# Altium schematic sheet power.SchDoc: Arduino_Power
size A4; DocumentNumber: 1; SheetNumber: 1; SheetTotal: 3
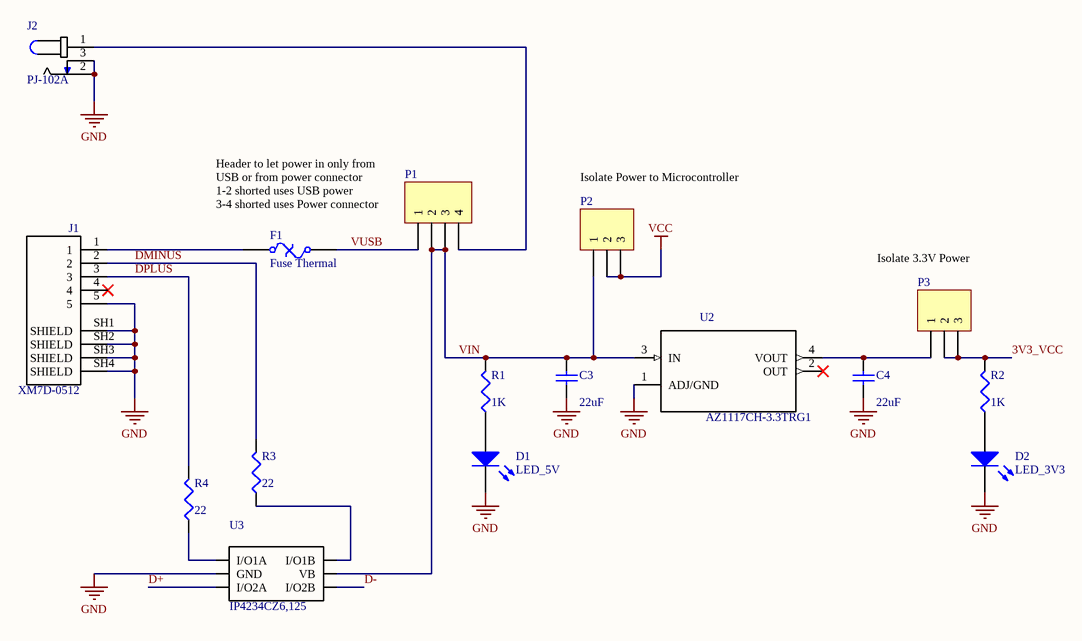
[diagram p0: power.SchDoc]

## Parts
C3  value 22uF  [C1206]  (hidden comment: Cap Semi)
C4  value 22uF  [C1206]  (hidden comment: Cap Semi)
D1  LED_5V  [3.2X1.6X1.1]
D2  LED_3V3  [3.2X1.6X1.1]
F1  Fuse Thermal  [1812]
J1  XM7D-0512  [*OMRON_XM7D-0512_XM7D-0512(Primary)]
J2  PJ-102A  [*CUI_PJ-102A]
P1  Header 4  [HDR1X4]  (value not drawn)
P2  ON   OFF  [HDR1X3]  (value not drawn)
P3  3.3 NC  [HDR1X3]  (value not drawn)
R1  value 1K  [C1206]  (hidden comment: Res3)
R2  value 1K  [C1206]  (hidden comment: Res3)
R3  value 22  [C1206]  (hidden comment: Res3)
R4  value 22  [C1206]  (hidden comment: Res3)
U2  AZ1117CH-3.3TRG1  [*SOT230P696X180-4N]
U3  IP4234CZ6,125  [*SOT-457]

## Nets
GND: C3.1 C4.1 D1.2(K) D2.2(K) J1.5 J1.SH1(SHIELD) J1.SH2(SHIELD) J1.SH3(SHIELD) J1.SH4(SHIELD) J2.2 J2.3 U2.1(ADJ/GND) U3.2(GND)
VCC: P2.2 P2.3
3V3_VCC: P3.2 P3.3 R2.2
D+: U3.3(I/O2A)
D-: U3.4(I/O2B)
DMINUS: J1.2 R3.2
DPLUS: J1.3 R4.2
VIN: C3.2 P1.2 P1.3 P2.1 R1.2 U2.3(IN) U3.5(VB)
VUSB: F1.2 P1.1
NetC4_2: C4.2 P3.1 U2.4(VOUT)
NetD1_1: D1.1(A) R1.1
NetD2_1: D2.1(A) R2.1
NetF1_1: F1.1 J1.1
NetJ2_1: J2.1 P1.4
NetR3_1: R3.1 U3.6(I/O1B)
NetR4_1: R4.1 U3.1(I/O1A)

Not connected (* = marked no-connect by the designer): J1 4*; U2 2(OUT)*

## Notes on the sheet
- Isolate Power to Microcontroller
- Header to let power in only from
  USB or from power connector
  1-2 shorted uses USB power
  3-4 shorted uses Power connector
- Isolate 3.3V Power
- Title
- Size:
- Date:
- A4
- Number:
- Time:
- Revision:
- Sheet
- of
- File:

## Library data of the parts
C3 C4 = Cap Semi: Capacitor (Semiconductor SIM Model); Published: 8-Jun-2000; LatestRevisionDate: 29-May-2009; LatestRevisionNote: IPC-7351 Footprint Added.; PackageReference: C1206; Publisher: Altium Limited; PackageDescription: Chip Capacitor; DigiKeyPartNo: 1276-3300-1-ND
D1 D2 = LED2: Typical RED, GREEN, YELLOW, AMBER GaAs LED; Published: 8-Jun-2000; LatestRevisionDate: 17-Jul-2002; LatestRevisionNote: Re-released for DXP Platform.; PackageVersion: Feb-2002; PackageReference: 3.2X1.6X1.1; Publisher: Altium Limited; PackageDescription: SM LED; 2 Flat Leads
F1 = Fuse Thermal: Thermal Fuse; ManufacturerPartNo: MF-MSMF050-2; Published: 24-Mar-1999; LatestRevisionDate: 17-Jul-2002; LatestRevisionNote: Re-released for DXP Platform.; PackageReference: 1812; Publisher: Altium Limited; PackageDescription: Thru-Hole; 2 Leads; DigiKeyPartNo: MF-MSMF050-2CT-ND
J1 = XM7D-0512: Conn Mini USB Type B SKT 5 POS 0.8mm Solder RA Thru-Hole 5 Terminal 1 Port; MF: Omron Electronics; Availability: Unavailable; MP: XM7D-0512; SnapEDA_Link: https://www.snapeda.com/parts/XM7D-0512/Omron%20Electronics%20Inc-EMC%20Div/view-part/?ref=snap; Price: None; Package: None; Value: *; ComponentLink1URL: https://www.digikey.com/product-detail/en/omron-electronics-inc-emc-div/XM7D-0512/OR1205-ND/4695531
J2 = PJ-102A: 2.0 mm Center Pin, 2.5 A, Right Angle, Through Hole, Tapered Pins, Dc Power Jack Connector; MF: CUI Inc.; Price: None; CUI_purchase_URL: https://www.cui.com/product/interconnect/dc-power-connectors/jacks/2.0-mm-center-pin/pj-102a?utm_source=snapeda.com&utm_medium=referral&utm_campaign=snapedaBOM; Package: None; SnapEDA_Link: https://www.snapeda.com/parts/PJ-102A/CUI%20Inc./view-part/?ref=snap; Availability: Unavailable; MP: PJ-102A; Value: *
P1 = Header 4: Header, 4-Pin; LatestRevisionDate: 17-Jul-2002; LatestRevisionNote: Re-released for DXP Platform.; Publisher: Altium Limited
P2 P3 = Header 3: Header, 3-Pin; LatestRevisionDate: 17-Jul-2002; LatestRevisionNote: Re-released for DXP Platform.; Publisher: Altium Limited
R1-R4 = Res3: Resistor; Published: 8-Jun-2000; LatestRevisionDate: 29-May-2009; LatestRevisionNote: IPC-7351 Footprint Added.; PackageReference: J1-0603; Publisher: Altium Limited; PackageDescription: Chip Resistor
U2 = LM1117MP-3.3: Voltage stabiliser; LDO, fixed; 3.3V; 0.8A; SOT223; SMD; MF: Diodes Incorporated; Price: None; Package: SOT-223 Texas Instruments; SnapEDA_Link: https://www.snapeda.com/parts/LM1117MP-3.3/NOPB/Texas%20Instruments/view-part/?ref=snap; Availability: Unavailable; MP: AZ1117CH-3.3TRG1; Value: *; DigiKeyPartNo: AZ1117CH-3.3TRG1DICT-ND
U3 = IP4234CZ6: DIODE, ESD TVS, USB2.0, SOT457; Operating Voltage: 3V; No. of Pins: 6; SVHC: No SVHC _18-Jun-2010_; MF: NXP Semiconductors; Package: SO-6 NXP Semiconductors; MP: IP4234CZ6,125; Price: None; SnapEDA_Link: https://www.snapeda.com/parts/IP4234CZ6/NXP%20Semiconductors/view-part/?ref=snap; Availability: Unavailable; Value: *